# EAGLE design rcontrol (EAGLE 6.5.0)
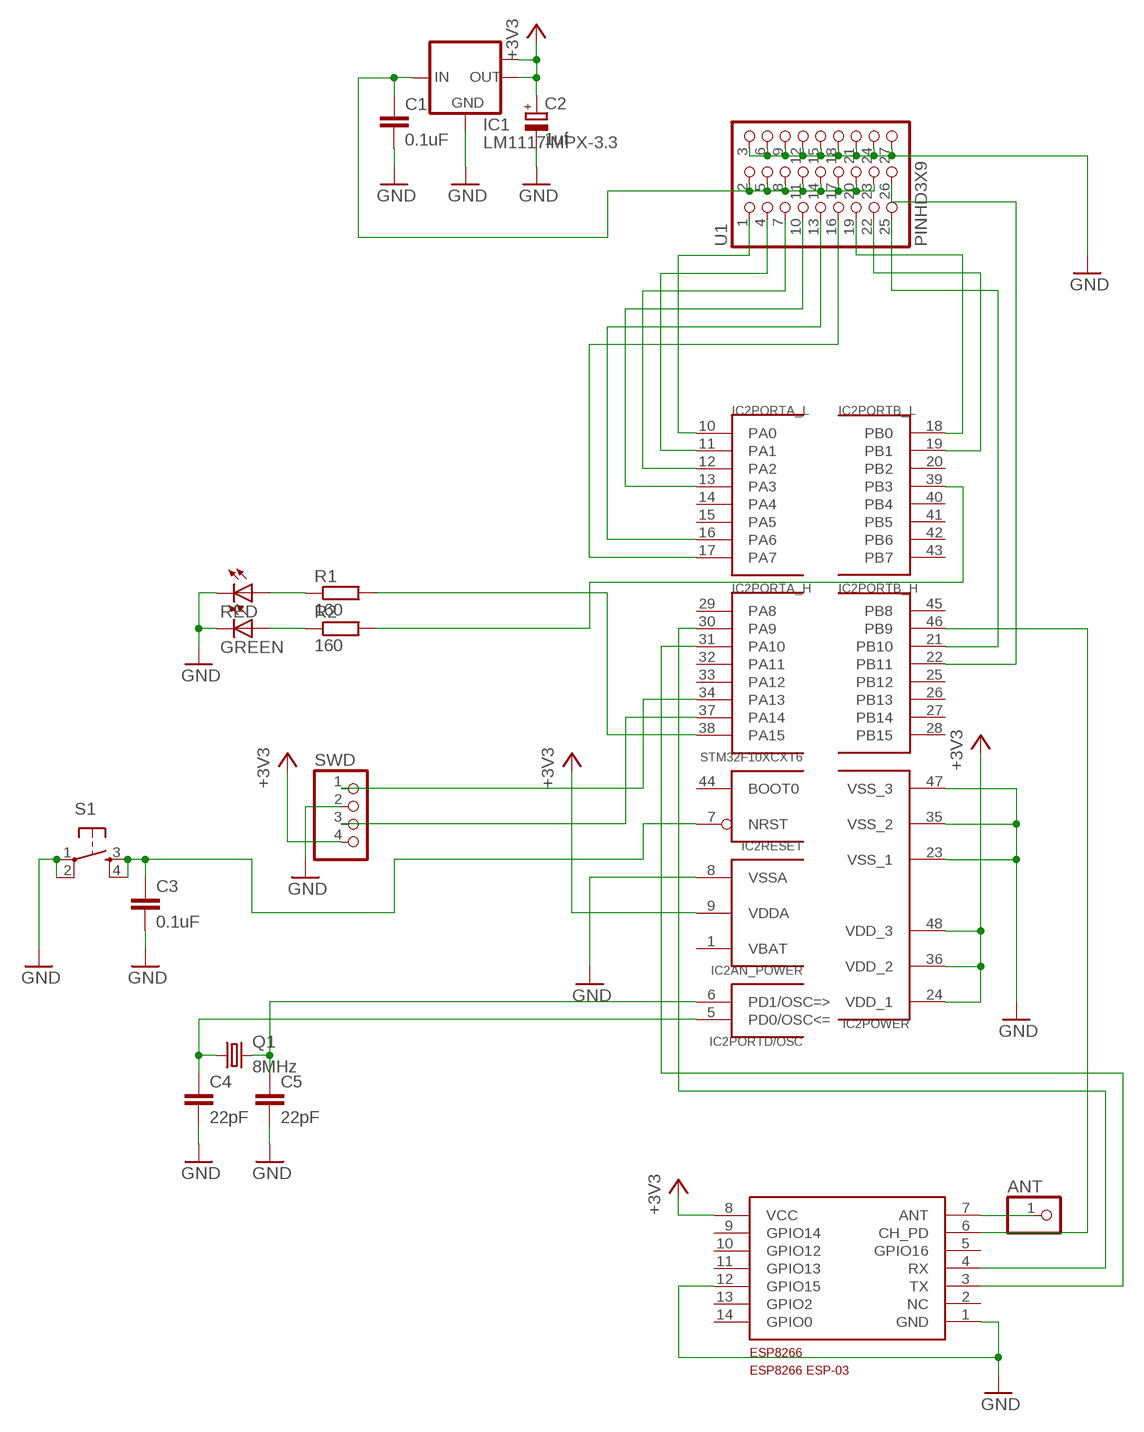
[diagram p0: schematic, sheet 1]

## Parts
ANT  PINHD-1X1  [1X01]
C1  0.1uF  C-EUC1206  [C1206]
C2  1uf  CPOL-EUCT3528  [CT3528]
C3  0.1uF  C-EUC0805  [C0805]
C4  22pF  C-EUC0805  [C0805]
C5  22pF  C-EUC0805  [C0805]
ESP8266  ESP8266_ESP-03  [ESP-03]
GREEN  LEDCHIP-LED0805  [CHIP-LED0805]
IC1  LM1117IMPX-3.3  [SOT223]
IC2  STM32F10XCXT6  [TQFP48]
Q1  8MHz  CRYSTALHC49U-V  [HC49U-V]
R1  160  R-EU_R0805  [R0805]
R2  160  R-EU_R0805  [R0805]
RED  LEDCHIP-LED0805  [CHIP-LED0805]
S1  TAC_SWITCHSMD  [TACTILE_SWITCH_SMD]
SWD  PINHD-1X4  [1X04]
U1  PINHD3X9  [3X9]

## Nets
+3V3: C2.+ ESP8266.8(VCC) IC1.2(OUT) IC1.TAB(OUT1) IC2.9(AN_POWER:VDDA) IC2.24(POWER:VDD_1) IC2.36(POWER:VDD_2) IC2.48(POWER:VDD_3) SWD.4
GND: C1.2 C2.- C3.2 C4.2 C5.2 ESP8266.1(GND) ESP8266.12(GPIO15) GREEN.C IC1.1(GND) IC2.8(AN_POWER:VSSA) IC2.23(POWER:VSS_1) IC2.35(POWER:VSS_2) IC2.47(POWER:VSS_3) RED.C S1.1 S1.2 SWD.2 U1.3 U1.6 U1.9 U1.12 U1.15 U1.18 U1.21 U1.24 U1.27
N$1: IC2.10(PORTA_L:PA0) U1.1
N$2: IC2.11(PORTA_L:PA1) U1.4
N$3: IC2.12(PORTA_L:PA2) U1.7
N$4: IC2.13(PORTA_L:PA3) U1.10
N$5: IC2.16(PORTA_L:PA6) U1.13
N$6: C4.1 IC2.5(PORTD/OSC:PD0/OSC<=) Q1.1
N$7: IC2.17(PORTA_L:PA7) U1.16
N$8: IC2.18(PORTB_L:PB0) U1.19
N$9: ANT.1 ESP8266.7(ANT)
N$10: IC2.19(PORTB_L:PB1) U1.22
N$11: IC2.21(PORTB_H:PB10) U1.25
N$12: IC2.22(PORTB_H:PB11) U1.26
N$13: ESP8266.4(RX) IC2.30(PORTA_H:PA9)
N$14: ESP8266.3(TX) IC2.31(PORTA_H:PA10)
N$15: IC2.34(PORTA_H:PA13) SWD.1
N$16: IC2.37(PORTA_H:PA14) SWD.3
N$17: IC2.38(PORTA_H:PA15) R1.2
N$18: IC2.39(PORTB_L:PB3) R2.2
N$19: ESP8266.6(CH_PD) IC2.46(PORTB_H:PB9)
N$20: R1.1 RED.A
N$21: GREEN.A R2.1
N$23: C1.1 IC1.3(IN) U1.2 U1.5 U1.8 U1.11 U1.14 U1.17 U1.20 U1.23
N$36: C3.1 IC2.7(RESET:NRST) S1.3 S1.4
N$37: C5.1 IC2.6(PORTD/OSC:PD1/OSC=>) Q1.2
Unconnected: ESP8266.2(NC) ESP8266.5(GPIO16) ESP8266.9(GPIO14) ESP8266.10(GPIO12) ESP8266.11(GPIO13) ESP8266.13(GPIO2) ESP8266.14(GPIO0) IC2.2(PORTC:PC13) IC2.3(PORTC:PC14) IC2.4(PORTC:PC15) IC2.14(PORTA_L:PA4) IC2.15(PORTA_L:PA5) IC2.20(PORTB_L:PB2) IC2.25(PORTB_H:PB12) IC2.26(PORTB_H:PB13) IC2.27(PORTB_H:PB14) IC2.28(PORTB_H:PB15) IC2.29(PORTA_H:PA8) IC2.32(PORTA_H:PA11) IC2.33(PORTA_H:PA12) IC2.40(PORTB_L:PB4) IC2.41(PORTB_L:PB5) IC2.42(PORTB_L:PB6) IC2.43(PORTB_L:PB7) IC2.44(RESET:BOOT0) IC2.45(PORTB_H:PB8)

## Power pins joined to a net without a drawn wire
VBAT: IC2.1(AN_POWER:VBAT)

## Library data of the parts
ANT = pinhead:PINHD-1X1: PIN HEADER
C1 C3-C5 = rcl:C-EU: CAPACITOR, European symbol
C2 = rcl:CPOL-EU: POLARIZED CAPACITOR, European symbol
ESP8266 = ESP8266:ESP8266_ESP-03
GREEN RED = led:LED: LED OSRAM: - CHIPLED LG R971, LG N971, LY N971, LG Q971, LY Q971, LO R971, LY R971 LH N974, LH R974 LS Q976, LO Q976, LY Q976 LO Q996 - Hyper CHIPLED LW Q18S LB Q993, LB Q99A, LB R99A - SideLED LS A670, LO A670, LY A670, LG A670, LP A670 LB A673, LV A673, LT A673, LW A673 LH A674 LY A675 LS A676, LA A676, LO A676, LY A676, LW A676 LS A679, LY A679, LG A679 - Hyper Micro SIDELED® LS Y876, LA Y876, LO Y876, LY Y876 LT Y87S - SmartLED LW L88C, LW L88S LB L89C, LB L89S, LG L890 LS L89K, LO L89K, LY L89K LS L896, LA L896, LO L896, LY L896 - TOPLED LS T670, LO T670, LY T670, LG T670, LP T670 LSG T670, LSP T670, LSY T670, LOP T670, LYG T670 LG T671, LOG T671, LSG T671 LB T673, LV T673, LT T673, LW T673 LH T674 LS T676, LA T676, LO T676, LY T676, LB T676, LH T676, LSB T676, LW T676 LB T67C, LV T67C, LT T67C, LS T67K, LO T67K, LY T67K, LW E67C LS E67B, LA E67B, LO E67B, LY E67B, LB E67C, LV E67C, LT E67C LW T67C LS T679, LY T679, LG T679 LS T770, LO T770, LY T770, LG T770, LP T770 LB T773, LV T773, LT T773, LW T773 LH T774 LS E675, LA E675, LY E675, LS T675 LS T776, LA T776, LO T776, LY T776, LB T776 LHGB T686 LT T68C, LB T68C - Hyper Mini TOPLED® LB M676 - Mini TOPLED Santana® LG M470 LS M47K, LO M47K, LY M47K Source: http://www.osram.convergy.de LUXEON: - LUMILED® LXK2-PW12-R00, LXK2-PW12-S00, LXK2-PW14-U00, LXK2-PW14-V00 LXK2-PM12-R00, LXK2-PM12-S00, LXK2-PM14-U00 LXK2-PE12-Q00, LXK2-PE12-R00, LXK2-PE12-S00, LXK2-PE14-T00, LXK2-PE14-U00 LXK2-PB12-K00, LXK2-PB12-L00, LXK2-PB12-M00, LXK2-PB14-N00, LXK2-PB14-P00, LXK2-PB14-Q00 LXK2-PR12-L00, LXK2-PR12-M00, LXK2-PR14-Q00, LXK2-PR14-R00 LXK2-PD12-Q00, LXK2-PD12-R00, LXK2-PD12-S00 LXK2-PH12-R00, LXK2-PH12-S00 LXK2-PL12-P00, LXK2-PL12-Q00, LXK2-PL12-R00 Source: www.luxeon.com KINGBRIGHT: KA-3528ASYC Source: www.kingbright.com
IC1 = lm1117:LM1117IMPX-*
IC2 = STM32:STM32F10XCXT6: ST STM32F101/103 48pin LQFP
Q1 = crystal:CRYSTAL: CRYSTAL; OC_FARNELL: 1666969; OC_NEWARK: unknown
R1 R2 = rcl:R-EU_: RESISTOR, European symbol
S1 = SparkFun-Electromechanical:TAC_SWITCH: Momentary Switch Button commonly used for reset or general input. Spark Fun Electronics SKU : COM-00097 SMT- SWCH-08247; PROD_ID: SWCH-08247
SWD = pinhead:PINHD-1X4: PIN HEADER
U1 = pinheader3x9:PINHD3X9

## Board
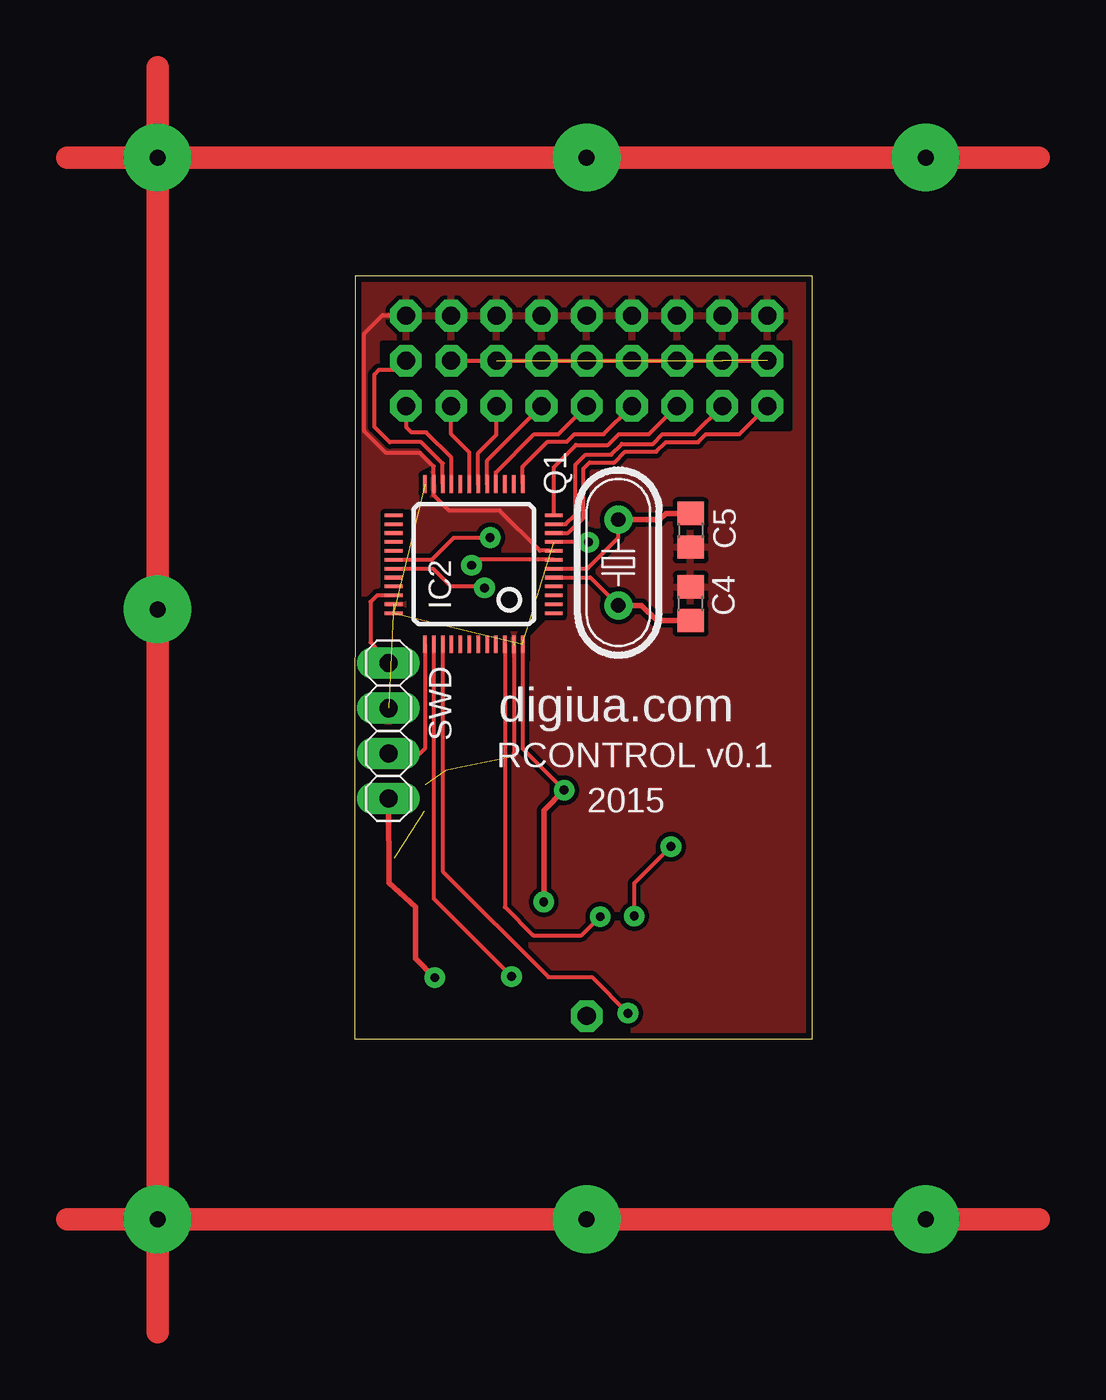
[diagram p1: board, top side]
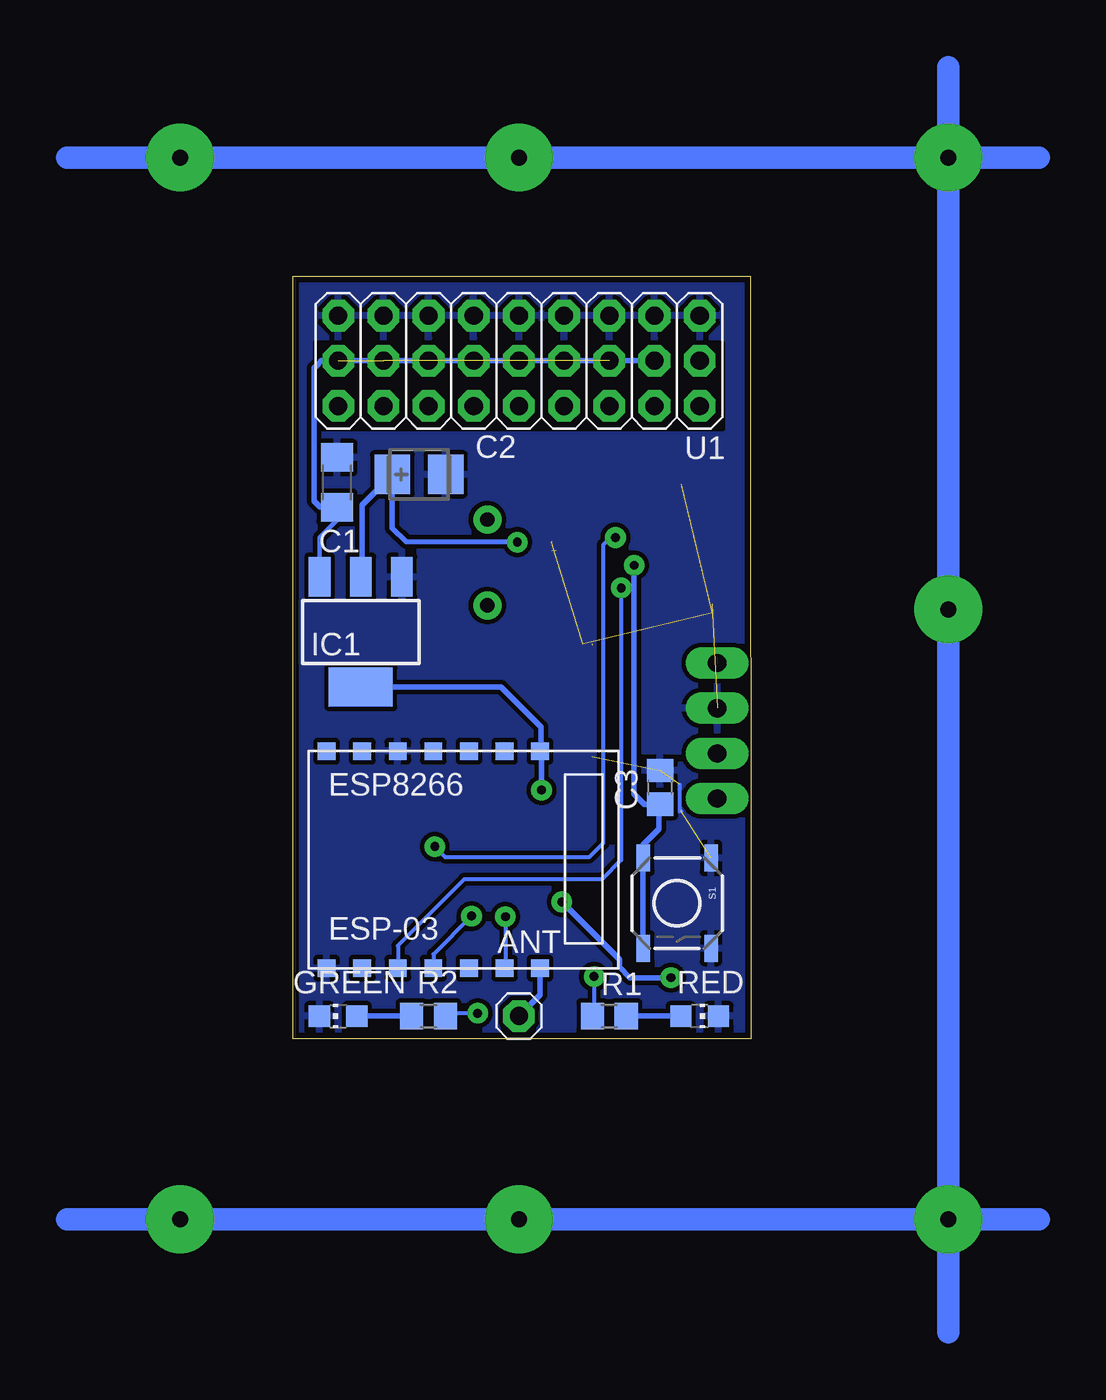
[diagram p2: board, bottom side, seen from below]

Size 25.73 x 42.85 mm. Coordinates in mm from the lower left corner, seen from the top.
Outline: 0,0 25.73,0 25.73,42.85 0.03,42.85 0,0
Copper layers (1*16): Top 0.035mm / dielectric 1.5mm / Bottom 0.035mm
Design rules "dirt_cheap_dirty_boards.v1": minimum track width 10mil, minimum drill 12mil, track to track 10mil, track to pad 10mil, pad to pad 10mil, via to via 10mil, smd to smd 0mil, copper to edge 13mil, drill to drill 13mil, minimum pad ring 15mil, minimum via ring 13mil, stop-mask expansion 10mil, vias tented up to drill 25mil, thermal gap 10mil
tRestrict: 79 lines
bRestrict: 4 lines

### Footprints (pad centres in the part's own frame; a part is rotated, then mirrored left to right if it is on the bottom)
1X01 = drill 1.016 octagon: 1 0,0
C1206 = smd 1.6 x 1.8: 1 -1.4,0; 2 1.4,0
CT3528 = smd 2 x 2.2: + -1.5,0; - 1.5,0
C0805 = smd 1.3 x 1.5: 1 -0.95,0; 2 0.95,0
ESP-03 = smd 1 x 1: 1 6.2,-7; 2 6.2,-5; 3 6.2,-3; 4 6.2,-1; 5 6.2,1; 6 6.2,3; 7 6.2,5; 8 -6,5; 9 -6,3; 10 -6,1; 11 -6,-1; 12 -6,-3; 13 -6,-5; 14 -6,-7
CHIP-LED0805 = smd 1.2 x 1.2: A 0,-1.05; C 0,1.05
SOT223 = smd 1.219 x 2.235: 1 -2.311,-3.099; 2 0,-3.099; 3 2.311,-3.099 | smd 3.6 x 2.2: TAB 0,3.099
TQFP48 = smd 0.2 x 1: 1 -2.75,-4.5; 2 -2.25,-4.5; 3 -1.75,-4.5; 4 -1.25,-4.5; 5 -0.75,-4.5; 6 -0.25,-4.5; 7 0.25,-4.5; 8 0.75,-4.5; 9 1.25,-4.5; 10 1.75,-4.5; 11 2.25,-4.5; 12 2.75,-4.5; 25 2.75,4.5; 26 2.25,4.5; 27 1.75,4.5; 28 1.25,4.5; 29 0.75,4.5; 30 0.25,4.5; 31 -0.25,4.5; 32 -0.75,4.5; 33 -1.25,4.5; 34 -1.75,4.5; 35 -2.25,4.5; 36 -2.75,4.5 | smd 1 x 0.2: 13 4.5,-2.75; 14 4.5,-2.25; 15 4.5,-1.75; 16 4.5,-1.25; 17 4.5,-0.75; 18 4.5,-0.25; 19 4.5,0.25; 20 4.5,0.75; 21 4.5,1.25; 22 4.5,1.75; 23 4.5,2.25; 24 4.5,2.75; 37 -4.5,2.75; 38 -4.5,2.25; 39 -4.5,1.75; 40 -4.5,1.25; 41 -4.5,0.75; 42 -4.5,0.25; 43 -4.5,-0.25; 44 -4.5,-0.75; 45 -4.5,-1.25; 46 -4.5,-1.75; 47 -4.5,-2.25; 48 -4.5,-2.75
HC49U-V = drill 0.813: 1 -2.413,0; 2 2.413,0
R0805 = smd 1.3 x 1.5: 1 -0.95,0; 2 0.95,0
TACTILE_SWITCH_SMD = smd 1.524 x 0.762: 1 -2.54,1.905; 2 2.54,1.905; 3 -2.54,-1.905; 4 2.54,-1.905
1X04 = drill 1.016 long: 1 -3.81,0; 2 -1.27,0; 3 1.27,0; 4 3.81,0
3X9 = drill 1.016 octagon: 1 1.27,1.27; 2 1.27,3.81; 3 1.27,6.35; 4 3.81,1.27; 5 3.81,3.81; 6 3.81,6.35; 7 6.35,1.27; 8 6.35,3.81; 9 6.35,6.35; 10 8.89,1.27; 11 8.89,3.81; 12 8.89,6.35; 13 11.43,1.27; 14 11.43,3.81; 15 11.43,6.35; 16 13.97,1.27; 17 13.97,3.81; 18 13.97,6.35; 19 16.51,1.27; 20 16.51,3.81; 21 16.51,6.35; 22 19.05,1.27; 23 19.05,3.81; 24 19.05,6.35; 25 21.59,1.27; 26 21.59,3.81; 27 21.59,6.35

### Placement (x,y rotation side)
ANT  13.05,1.27 0 bottom
C1  23.27,31.27 90 bottom
C2  18.67,31.72 0 bottom
C3  5.11,14.13 90 bottom
C4  18.89,24.45 90 top
C5  18.89,28.57 270 top
ESP8266  16.86,10.16 270 bottom
GREEN  23.21,1.27 90 bottom
IC1  21.94,22.86 180 bottom
IC2  6.7,26.67 90 top
Q1  14.83,26.77 90 top
R1  7.97,1.27 180 bottom
R2  18.13,1.27 0 bottom
RED  2.89,1.27 270 bottom
S1  4.16,7.62 270 bottom
SWD  1.91,17.3 270 top
U1  24.48,34.29 0 bottom

### Tracks (layer width: path | path; a pad name or v marks a point on that pad's centre or on a via)
+3V3  (via drill 0.5)  (4 unrouted)
  Top 0.229: v13.14,27.91 11.22,27.91 | IC2.48 9.45,16.3 v11.78,13.97
  Top 0.305: SWD.4 1.94,8.76 3.43,7.4 3.43,4.51 v4.51,3.43 | v10.64,7.68 10.64,12.83 v11.78,13.97
  Bottom 0.305: IC1.2 21.88,26.02 21.88,30 C2.+ 20.17,28.71 19.4,27.94 v13.14,27.91 | v4.51,3.43 6.79,3.43 7.4,4.03 7.4,4.45 v10.64,7.68 | v11.78,13.97 11.78,16.08 ESP8266.8 11.81,16.21 11.81,17.53 14.05,19.76 IC1.TAB
GND  (6 unrouted)
  Top 0.229: 8.95,22.13 8.95,15.88 | 10.95,27.43 10.41,27.43 8.16,29.69 5.3,29.69 4.45,30.54 IC2.23 | IC2.23 4.45,32.16 3.68,32.92 1.78,32.92 0.54,34.16 0.54,39.62 1.59,40.67 2.86,40.67 U1.27
  Bottom 0.229: 3.94,12.79 4,12.79 4,14.29
  pour Bottom: 0.35,43.18 25.75,43.18 25.75,0 0.35,0
  pour Top: 0.35,43.18 25.75,43.18 25.75,0 0.35,0
N$1
  Top 0.229: IC2.10 12.01,28.42 12.86,29.27 12.86,32.04 13.21,32.38 14.61,32.38 15.21,32.99 16.95,32.99 17.49,33.53 19.3,33.53 19.75,33.97 21.62,33.97 U1.1
N$2
  Top 0.229: IC2.11 11.87,28.92 12.41,29.46 12.41,32.26 12.99,32.83 14.41,32.83 15.02,33.43 16.76,33.43 17.3,33.97 19.08,33.97 U1.4
N$3
  Top 0.229: IC2.12 11.2,32.12 12.45,33.37 14.26,33.37 14.86,33.97 16.54,33.97 U1.7
N$4
  Top 0.229: IC2.13 9.45,32.15 10.86,33.56 11.94,33.56 12.35,33.97 14,33.97 U1.10
N$5
  Top 0.229: IC2.16 7.95,31.82 10.1,33.97 11.46,33.97 U1.13
N$6
  Top 0.229: IC2.5 13.26,25.92 Q1.1
  Top 0.305: Q1.1 16.13,24.35 16.99,23.5 C4.1
N$7
  Top 0.229: IC2.17 7.45,32.5 U1.16
N$8
  Top 0.229: IC2.18 6.95,32.92 7.97,33.94 U1.19
N$9
  Bottom 0.305: ESP8266.7 11.86,2.46 ANT.1
N$10
  Top 0.229: IC2.19 6.45,32.95 5.43,33.97 U1.22
N$11
  Top 0.229: IC2.21 5.45,32.65 4.03,34.07 3.21,34.07 2.92,34.35 2.92,35.53 U1.25
N$12
  Top 0.229: IC2.22 4.95,32.33 3.75,33.53 1.97,33.53 1.11,34.38 1.11,37.34 1.37,37.59 2.38,37.59 U1.26
N$13  (via drill 0.5)
  Top 0.229: IC2.30 4.35,26.92 5.59,28.16 v7.62,28.16 | v17.78,10.79 15.72,8.73 v15.72,6.89
  Bottom 0.229: v7.62,28.16 7.91,28.16 8.32,27.75 8.32,10.99 9.11,10.19 17.18,10.19 v17.78,10.79 | v15.72,6.89 17.86,4.75 ESP8266.4
N$14  (via drill 0.5)
  Top 0.229: IC2.31 4.41,26.42 5.4,25.43 7.21,25.43 v7.3,25.34
  Bottom 0.229: v7.3,25.34 7.3,10.03 8.38,8.95 16.13,8.95 19.84,5.24 19.84,3.98 ESP8266.3
N$15
  Top 0.229: IC2.34 1.27,24.92 0.89,24.54 0.89,22.29 SWD.1
N$16
  Top 0.229: IC2.37 3.95,16.3 3.65,16 2.1,16 SWD.3
N$17  (via drill 0.5)
  Top 0.229: IC2.38 4.45,7.87 v8.83,3.49
  Bottom 0.229: v8.83,3.49 8.83,1.36 R1.2
N$18  (via drill 0.5)
  Top 0.229: IC2.39 4.95,9.4 10.89,3.46 13.34,3.46 v15.37,1.43
  Bottom 0.229: v15.37,1.43 17.02,1.43 R2.2
N$19  (via drill 0.5)
  Top 0.229: IC2.46 8.45,7.39 10.03,5.81 12.76,5.81 v13.81,6.86
  Bottom 0.229: v13.81,6.86 13.81,4.01 ESP8266.6
N$20
  Bottom 0.305: RED.A R1.1
N$21
  Bottom 0.305: GREEN.A R2.1
N$22  (via drill 0.9 pad 3.81)
  other vias: 32.1,49.53
N$23  (6 unrouted)
  Top 0.229: U1.23 U1.2
  Bottom 0.254: IC1.3 24.25,28.17 23.21,29.21 23.21,29.81 C1.1
  Bottom 0.305: C1.1 24.23,29.88 24.57,30.23 24.57,37.69 24.32,37.94 24.16,38.1 U1.23
N$24  (via drill 0.9 pad 3.81)
  other vias: 13.05,49.53
N$25  (via drill 0.9 pad 3.81)
  other vias: -11.08,49.53
N$26  (via drill 0.9 pad 3.81)
  other vias: -11.08,24.13
N$27  (via drill 0.9 pad 3.81)
  other vias: -11.08,-10.16
N$28  (via drill 0.9 pad 3.81)
  other vias: 13.05,-10.16
N$29
  Top 1.27: 38.45,49.53 -16.16,49.53
N$30  (via drill 0.9 pad 3.81)
  other vias: 32.1,-10.16
N$31
  Top 1.27: -11.08,54.61 -11.08,-16.51
N$32
  Top 1.27: -16.16,-10.16 38.45,-10.16
N$33
  Bottom 1.27: 38.45,49.53 -16.16,49.53
N$34
  Bottom 1.27: -11.08,54.61 -11.08,-16.51
N$35
  Bottom 1.27: -16.16,-10.16 38.45,-10.16
N$36  (via drill 0.5)
  Top 0.229: IC2.7 6.89,26.92 v6.57,26.61
  Bottom 0.305: S1.4 S1.3 6.06,10.89 5.18,11.78 5.18,13.12 C3.1 6,13.18 6.57,13.75 v6.57,26.61
N$37
  Top 0.229: IC2.6 13.09,26.42 14.83,28.16 Q1.2
  Top 0.305: Q1.2 17.15,29.18 17.49,29.53 C5.1

### Text on the board
tNames: digiua.com | RCONTROL v0.1 | 2015